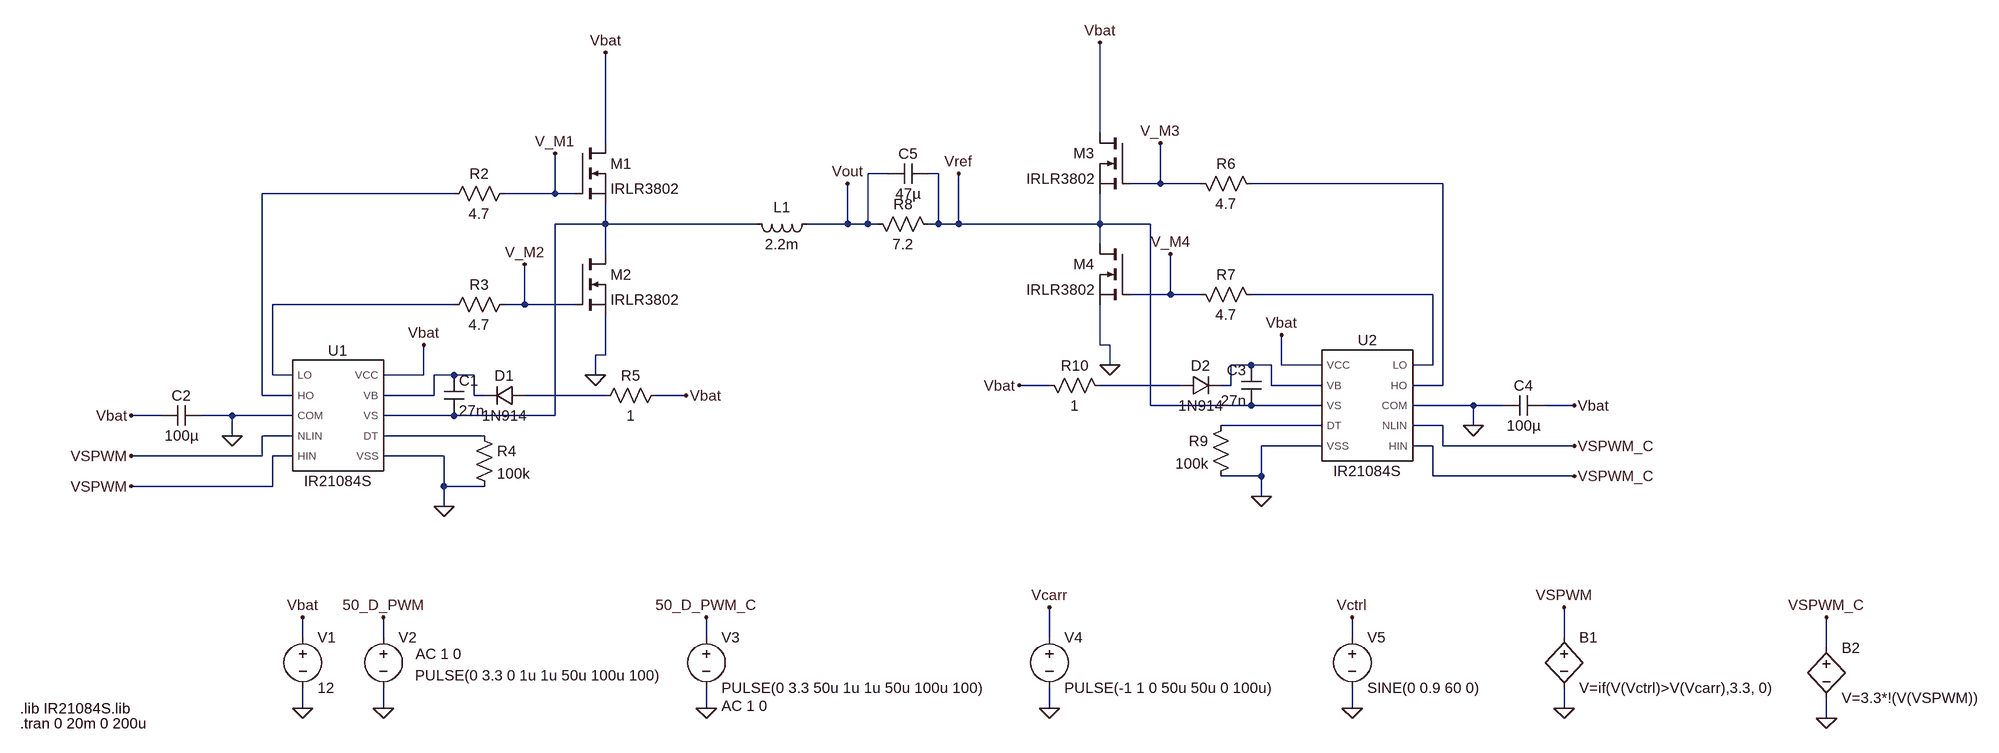
[diagram p0: schematic IR21084S Full Bridge Simulation - SPWM.asc]
IR21084S Full Bridge Simulation - SPWM.asc, the LTspice schematic file:
Version 4
SHEET 1 880 680
WIRE -720 -736 -720 -880
WIRE -1504 -720 -1504 -864
WIRE -1056 -672 -1088 -672
WIRE -976 -672 -992 -672
WIRE -624 -656 -624 -720
WIRE -624 -656 -672 -656
WIRE -560 -656 -624 -656
WIRE -176 -656 -480 -656
WIRE -1744 -640 -2048 -640
WIRE -1584 -640 -1584 -704
WIRE -1584 -640 -1664 -640
WIRE -1552 -640 -1584 -640
WIRE -1504 -592 -1504 -624
WIRE -1504 -592 -1584 -592
WIRE -1264 -592 -1504 -592
WIRE -1120 -592 -1120 -656
WIRE -1120 -592 -1184 -592
WIRE -1088 -592 -1088 -672
WIRE -1088 -592 -1120 -592
WIRE -1072 -592 -1088 -592
WIRE -976 -592 -976 -672
WIRE -976 -592 -992 -592
WIRE -944 -592 -944 -672
WIRE -944 -592 -976 -592
WIRE -720 -592 -720 -640
WIRE -720 -592 -944 -592
WIRE -640 -592 -720 -592
WIRE -720 -560 -720 -592
WIRE -1504 -544 -1504 -592
WIRE -608 -480 -608 -544
WIRE -608 -480 -672 -480
WIRE -560 -480 -608 -480
WIRE -192 -480 -480 -480
WIRE -1744 -464 -2032 -464
WIRE -1632 -464 -1632 -528
WIRE -1632 -464 -1664 -464
WIRE -1552 -464 -1632 -464
WIRE -720 -400 -720 -464
WIRE -704 -400 -720 -400
WIRE -1504 -384 -1504 -448
WIRE -1504 -384 -1520 -384
WIRE -704 -368 -704 -400
WIRE -480 -368 -512 -368
WIRE -448 -368 -480 -368
WIRE -432 -368 -432 -416
WIRE -368 -368 -432 -368
WIRE -192 -368 -192 -480
WIRE -192 -368 -224 -368
WIRE -2032 -352 -2032 -464
WIRE -2000 -352 -2032 -352
WIRE -1792 -352 -1792 -400
WIRE -1792 -352 -1856 -352
WIRE -1744 -352 -1776 -352
WIRE -1712 -352 -1744 -352
WIRE -1520 -352 -1520 -384
WIRE -800 -336 -848 -336
WIRE -592 -336 -720 -336
WIRE -512 -336 -512 -368
WIRE -512 -336 -528 -336
WIRE -448 -336 -448 -368
WIRE -368 -336 -448 -336
WIRE -176 -336 -176 -656
WIRE -176 -336 -224 -336
WIRE -2048 -320 -2048 -640
WIRE -2000 -320 -2048 -320
WIRE -1776 -320 -1776 -352
WIRE -1776 -320 -1856 -320
WIRE -1712 -320 -1712 -352
WIRE -1696 -320 -1712 -320
WIRE -1504 -320 -1632 -320
WIRE -1376 -320 -1424 -320
WIRE -640 -304 -640 -592
WIRE -480 -304 -640 -304
WIRE -368 -304 -480 -304
WIRE -128 -304 -224 -304
WIRE -80 -304 -128 -304
WIRE 32 -304 -16 -304
WIRE -2208 -288 -2256 -288
WIRE -2096 -288 -2144 -288
WIRE -2000 -288 -2096 -288
WIRE -1744 -288 -1856 -288
WIRE -1584 -288 -1584 -592
WIRE -1584 -288 -1744 -288
WIRE -368 -272 -528 -272
WIRE -176 -272 -224 -272
WIRE -128 -272 -128 -304
WIRE -2096 -256 -2096 -288
WIRE -2000 -256 -2048 -256
WIRE -1696 -256 -1856 -256
WIRE -368 -240 -464 -240
WIRE -192 -240 -224 -240
WIRE -176 -240 -176 -272
WIRE 32 -240 -176 -240
WIRE -2048 -224 -2048 -256
WIRE -2048 -224 -2256 -224
WIRE -2000 -224 -2032 -224
WIRE -1760 -224 -1856 -224
WIRE -464 -192 -464 -240
WIRE -464 -192 -528 -192
WIRE -192 -192 -192 -240
WIRE 32 -192 -192 -192
WIRE -2032 -176 -2032 -224
WIRE -2032 -176 -2256 -176
WIRE -1760 -176 -1760 -224
WIRE -1696 -176 -1760 -176
WIRE -464 -160 -464 -192
WIRE -1760 -144 -1760 -176
WIRE -1984 64 -1984 32
WIRE -1856 64 -1856 32
WIRE -1344 64 -1344 32
WIRE -800 64 -800 16
WIRE -320 64 -320 32
WIRE 16 64 16 16
WIRE 432 80 432 32
WIRE -1984 176 -1984 144
WIRE -1856 176 -1856 144
WIRE -1344 176 -1344 144
WIRE -800 176 -800 144
WIRE -320 176 -320 144
WIRE 16 176 16 144
WIRE 432 192 432 160
FLAG -1984 176 0
FLAG -1984 32 Vbat
FLAG -1504 -864 Vbat
FLAG -1520 -352 0
FLAG -1760 -144 0
FLAG -1376 -320 Vbat
FLAG -1792 -400 Vbat
FLAG -2256 -288 Vbat
FLAG -1856 32 50_D_PWM
FLAG -1856 176 0
FLAG -2256 -224 VSPWM
FLAG -1344 176 0
FLAG -1344 32 50_D_PWM_C
FLAG -2256 -176 VSPWM
FLAG -1120 -656 Vout
FLAG -2096 -256 0
FLAG -720 -880 Vbat
FLAG -704 -368 0
FLAG -464 -160 0
FLAG -848 -336 Vbat
FLAG -432 -416 Vbat
FLAG 32 -304 Vbat
FLAG 32 -240 VSPWM_C
FLAG 32 -192 VSPWM_C
FLAG -944 -672 Vref
FLAG -128 -272 0
FLAG -1584 -704 V_M1
FLAG -624 -720 V_M3
FLAG -608 -544 V_M4
FLAG -1632 -528 V_M2
FLAG -800 176 0
FLAG -800 16 Vcarr
FLAG -320 176 0
FLAG -320 32 Vctrl
FLAG 16 176 0
FLAG 432 192 0
FLAG 16 16 VSPWM
FLAG 432 32 VSPWM_C
SYMBOL nmos -1552 -720 R0
SYMATTR InstName M1
SYMATTR Value IRLR3802
SYMBOL nmos -1552 -544 R0
SYMATTR InstName M2
SYMATTR Value IRLR3802
SYMBOL res -1648 -656 R90
WINDOW 0 0 56 VBottom 2
WINDOW 3 32 56 VTop 2
SYMATTR InstName R2
SYMATTR Value 4.7
SYMBOL res -1648 -480 R90
WINDOW 0 0 56 VBottom 2
WINDOW 3 32 56 VTop 2
SYMATTR InstName R3
SYMATTR Value 4.7
SYMBOL voltage -1984 48 R0
WINDOW 123 0 0 Left 0
WINDOW 39 0 0 Left 0
SYMATTR InstName V1
SYMATTR Value 12
SYMBOL res -1712 -272 R0
SYMATTR InstName R4
SYMATTR Value 100k
SYMBOL diode -1632 -336 R90
WINDOW 0 0 32 VBottom 2
WINDOW 3 32 32 VTop 2
SYMATTR InstName D1
SYMATTR Value 1N914
SYMBOL cap -1760 -352 R0
SYMATTR InstName C1
SYMATTR Value 27n
SYMBOL cap -2144 -304 R90
WINDOW 0 0 32 VBottom 2
WINDOW 3 32 32 VTop 2
SYMATTR InstName C2
SYMATTR Value 100µ
SYMBOL voltage -1856 48 R0
WINDOW 3 50 76 Left 2
WINDOW 123 51 42 Left 2
WINDOW 39 0 0 Left 0
SYMATTR Value PULSE(0 3.3 0 1u 1u 50u 100u 100)
SYMATTR Value2 AC 1 0
SYMATTR InstName V2
SYMBOL voltage -1344 48 R0
WINDOW 123 24 124 Left 2
WINDOW 39 0 0 Left 0
SYMATTR Value2 AC 1 0
SYMATTR InstName V3
SYMATTR Value PULSE(0 3.3 50u 1u 1u 50u 100u 100)
SYMBOL IR21084S -1936 -288 R0
SYMATTR InstName U1
SYMBOL res -1408 -336 R90
WINDOW 0 0 56 VBottom 2
WINDOW 3 32 56 VTop 2
SYMATTR InstName R5
SYMATTR Value 1
SYMATTR SpiceLine tol=1 pwr=0.1
SYMBOL nmos -672 -736 M0
SYMATTR InstName M3
SYMATTR Value IRLR3802
SYMBOL nmos -672 -560 M0
SYMATTR InstName M4
SYMATTR Value IRLR3802
SYMBOL res -576 -672 M90
WINDOW 0 0 56 VBottom 2
WINDOW 3 32 56 VTop 2
SYMATTR InstName R6
SYMATTR Value 4.7
SYMBOL res -576 -496 M90
WINDOW 0 0 56 VBottom 2
WINDOW 3 32 56 VTop 2
SYMATTR InstName R7
SYMATTR Value 4.7
SYMBOL res -976 -576 M270
WINDOW 0 32 56 VTop 2
WINDOW 3 0 56 VBottom 2
SYMATTR InstName R8
SYMATTR Value 7.2
SYMBOL res -512 -288 M0
SYMATTR InstName R9
SYMATTR Value 100k
SYMBOL diode -592 -352 M90
WINDOW 0 0 32 VBottom 2
WINDOW 3 32 32 VTop 2
SYMATTR InstName D2
SYMATTR Value 1N914
SYMBOL cap -464 -368 M0
SYMATTR InstName C3
SYMATTR Value 27n
SYMBOL cap -80 -320 M90
WINDOW 0 0 32 VBottom 2
WINDOW 3 32 32 VTop 2
SYMATTR InstName C4
SYMATTR Value 100µ
SYMBOL IR21084S -288 -304 M0
SYMATTR InstName U2
SYMBOL res -816 -352 M90
WINDOW 0 0 56 VBottom 2
WINDOW 3 32 56 VTop 2
SYMATTR InstName R10
SYMATTR Value 1
SYMATTR SpiceLine tol=1 pwr=0.1
SYMBOL voltage -800 48 R0
WINDOW 123 0 0 Left 0
WINDOW 39 0 0 Left 0
SYMATTR InstName V4
SYMATTR Value PULSE(-1 1 0 50u 50u 0 100u)
SYMBOL voltage -320 48 R0
WINDOW 123 0 0 Left 0
WINDOW 39 0 0 Left 0
SYMATTR InstName V5
SYMATTR Value SINE(0 0.9 60 0)
SYMBOL bv 16 48 R0
SYMATTR InstName B1
SYMATTR Value V=if(V(Vctrl)>V(Vcarr),3.3, 0)
SYMBOL bv 432 64 R0
SYMATTR InstName B2
SYMATTR Value V=3.3*!(V(VSPWM))
SYMBOL ind -1168 -608 R90
WINDOW 0 5 56 VBottom 2
WINDOW 3 32 56 VTop 2
SYMATTR InstName L1
SYMATTR Value 2.2m
SYMBOL cap -992 -688 R90
WINDOW 0 0 32 VBottom 2
WINDOW 3 32 32 VTop 2
SYMATTR InstName C5
SYMATTR Value 47µ
TEXT -2432 200 Left 2 !.tran 0 20m 0 200u
TEXT -2432 176 Left 2 !.lib IR21084S.lib

The netlist it stands for:
* IR21084S Full Bridge Simulation - SPWM.asc
M1 Vbat V_M1 N003 N003 IRLR3802
M2 N003 V_M2 0 0 IRLR3802
R2 V_M1 N002 4.7
R3 V_M2 N005 4.7
V1 Vbat 0 12
R4 N011 0 100k
D1 N009 N007 1N914
C1 N007 N003 27n
C2 0 Vbat 100µ
V2 50_D_PWM 0 PULSE(0 3.3 0 1u 1u 50u 100u 100) AC 1 0
V3 50_D_PWM_C 0 PULSE(0 3.3 50u 1u 1u 50u 100u 100) AC 1 0
XU1 N005 N002 0 VSPWM VSPWM Vbat N007 N003 N011 0 IR21084S  ; pins LO HO COM NLIN HIN VCC VB VS DT VSS
R5 Vbat N009 1 tol=1 pwr=0.1
M3 Vbat V_M3 Vref Vref IRLR3802
M4 Vref V_M4 0 0 IRLR3802
R6 V_M3 N001 4.7
R7 V_M4 N004 4.7
R8 Vref Vout 7.2
R9 N010 0 100k
D2 N008 N006 1N914
C3 N006 Vref 27n
C4 0 Vbat 100µ
XU2 N004 N001 0 VSPWM_C VSPWM_C Vbat N006 Vref N010 0 IR21084S  ; pins LO HO COM NLIN HIN VCC VB VS DT VSS
R10 Vbat N008 1 tol=1 pwr=0.1
V4 Vcarr 0 PULSE(-1 1 0 50u 50u 0 100u)
V5 Vctrl 0 SINE(0 0.9 60 0)
B1 VSPWM 0 V=if(V(Vctrl)>V(Vcarr),3.3, 0)
B2 VSPWM_C 0 V=3.3*!(V(VSPWM))
L1 Vout N003 2.2m
C5 Vref Vout 47µ
.model D D
.lib standard.dio
.model NMOS NMOS
.model PMOS PMOS
.lib standard.mos
.tran 0 20m 0 200u
.lib IR21084S.lib
.lib C:\Users\Nicholas Chan\Downloads\Infineon-IR21084S-PSpice-SimulationModels-v01_00-EN\Model\IR21084S.lib
.backanno
.end